# EAGLE schematic plinkplonk5 (EAGLE 7.5.0)
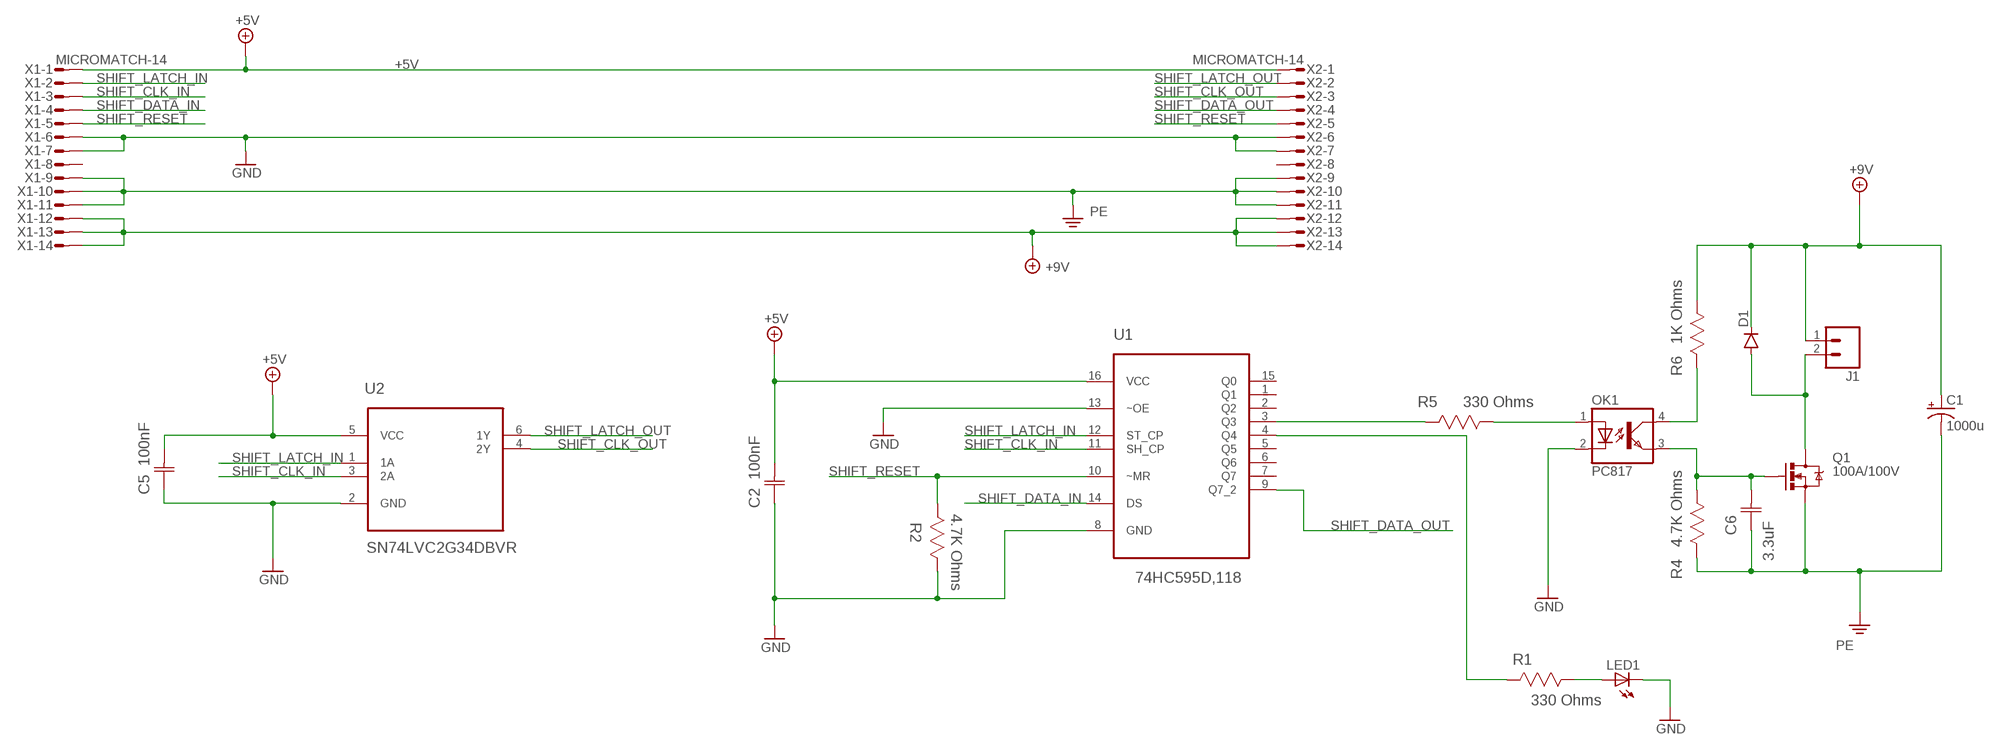
[diagram p0: schematic, sheet 1]

## Parts
C1  1000u  CAP_POLPTH4  [CPOL-RADIAL-1000UF-25V]
C2  100nF  C0805C104J5RACTU  [CAPC2013X110N]
C5  100nF  C0805C104J5RACTU  [CAPC2013X110N]
C6  3.3uF  C0805C104J5RACTU  [CAPC2013X110N]
D1  DIODEPTH  [DIODE-1N4001]
J1  M02JST-PTH-VERT  [JST-2-PTH-VERT]
LED1  LEDCHIPLED_1206  [CHIPLED_1206]
OK1  PC817  [DIL04]
Q1  100A/100V  MOSFET-NCHANNELPSMN7R0  [TO-263/D2PAK]
R1  330 Ohms  MC0.1W08051%9K1  [RESC2013X65N]
R2  4.7K Ohms  MC0.1W08051%9K1  [RESC2013X65N]
R4  4.7K Ohms  MC0.1W08051%9K1  [RESC2013X65N]
R5  330 Ohms  MC0.1W08051%9K1  [RESC2013X65N]
R6  1K Ohms  MC0.1W08051%9K1  [RESC2013X65N]
U1  74HC595D,118  [SOIC127P600X175-16N]
U2  SN74LVC2G34DBVR  [SOT95P280X145-6N]
X1  MICROMATCH-14  [MICROMATCH-14]
X2  MICROMATCH-14  [MICROMATCH-14]

## Nets
+5V: C2.2(C2) C5.2(C2) U1.16(VCC) U2.5(VCC) X1.1 X2.1
+9V: C1.+ D1.C J1.1 R6.1(R1) X1.12 X1.13 X1.14 X2.12 X2.13 X2.14
GND: C2.1(C1) C5.1(C1) LED1.C OK1.2(C) R2.1(R1) U1.8(GND) U1.13(~OE) U2.2(GND) X1.6 X1.7 X2.6 X2.7
N$1: D1.A J1.2 Q1.2(D)
N$2: R1.2(R2) U1.4(Q4)
N$3: C6.2(C2) OK1.3(EMIT) Q1.1(G) R4.1(R1)
N$4: LED1.A R1.1(R1)
N$5: OK1.4(COL) R6.2(R2)
N$6: R5.2(R2) U1.3(Q3)
N$7: OK1.1(A) R5.1(R1)
PE: C1.- C6.1(C1) Q1.3(S) R4.2(R2) X1.9 X1.10 X1.11 X2.9 X2.10 X2.11
SHIFT_CLK_IN: U1.11(SH_CP) U2.3(2A) X1.3
SHIFT_CLK_OUT: U2.4(2Y) X2.3
SHIFT_DATA_IN: U1.14(DS) X1.4
SHIFT_DATA_OUT: U1.9(Q7_2) X2.4
SHIFT_LATCH_IN: U1.12(ST_CP) U2.1(1A) X1.2
SHIFT_LATCH_OUT: U2.6(1Y) X2.2
SHIFT_RESET: R2.2(R2) U1.10(~MR) X1.5 X2.5
Unconnected: U1.1(Q1) U1.2(Q2) U1.5(Q5) U1.6(Q6) U1.7(Q7) U1.15(Q0) X1.8 X2.8

## Library data of the parts
C1 = SparkFun-Capacitors:CAP_POL: Capacitor Polarized These are standard SMD and PTH capacitors. Normally 10uF, 47uF, and 100uF in electrolytic and tantalum varieties. Always verify the external diameter of the through hole cap, it varies with capacity, voltage, and manufacturer. The EIA devices should be standard.
C2 C5 = Kemet_By_element14_Batch_1:C0805C104J5RACTU: CAPACITOR, 0805; MPN: C0805C104J5RACTU; OC_FARNELL: 1414663; OC_NEWARK: 64K2889; SUPPLIER: Kemet; TOLERANCE: ±5%; VOLTAGERATING: 50V
C6 = Kemet_By_element14_Batch_1:C0805C104J5RACTU: CAPACITOR, 0805; MPN: C0805C104J5RACTU; OC_FARNELL: 1414663; OC_NEWARK: 64K2889; SUPPLIER: Kemet; TOLERANCE: ±5%; VALUE: 100nF; VOLTAGERATING: 50V
D1 = SparkFun-DiscreteSemi:DIODE: Diode These are standard reverse protection diodes and small signal diodes. SMA package can handle up to about 1A. SOD-323 can handle about 200mA. What the SOD-323 package when ordering, there are some mfgs out there that are 5-pin packages.
J1 = SparkFun-Connectors:M02: Standard 2-pin 0.1" header. Use with - straight break away headers ( PRT-00116) - right angle break away headers (PRT-00553) - swiss pins (PRT-00743) - machine pins (PRT-00117) - female headers (PRT-00115) Molex polarized connector foot print use with: PRT-08233 with associated crimp pins and housings. 2.54_SCREWTERM for use with PRT-10571. 3.5mm Screw Terminal footprints for PRT-08084 5mm Screw Terminal footprints for use with PRT-08432
LED1 = led:LED: LED OSRAM: - CHIPLED LG R971, LG N971, LY N971, LG Q971, LY Q971, LO R971, LY R971 LH N974, LH R974 LS Q976, LO Q976, LY Q976 LO Q996 - Hyper CHIPLED LW Q18S LB Q993, LB Q99A, LB R99A - SideLED LS A670, LO A670, LY A670, LG A670, LP A670 LB A673, LV A673, LT A673, LW A673 LH A674 LY A675 LS A676, LA A676, LO A676, LY A676, LW A676 LS A679, LY A679, LG A679 - Hyper Micro SIDELED® LS Y876, LA Y876, LO Y876, LY Y876 LT Y87S - SmartLED LW L88C, LW L88S LB L89C, LB L89S, LG L890 LS L89K, LO L89K, LY L89K LS L896, LA L896, LO L896, LY L896 - TOPLED LS T670, LO T670, LY T670, LG T670, LP T670 LSG T670, LSP T670, LSY T670, LOP T670, LYG T670 LG T671, LOG T671, LSG T671 LB T673, LV T673, LT T673, LW T673 LH T674 LS T676, LA T676, LO T676, LY T676, LB T676, LH T676, LSB T676, LW T676 LB T67C, LV T67C, LT T67C, LS T67K, LO T67K, LY T67K, LW E67C LS E67B, LA E67B, LO E67B, LY E67B, LB E67C, LV E67C, LT E67C LW T67C LS T679, LY T679, LG T679 LS T770, LO T770, LY T770, LG T770, LP T770 LB T773, LV T773, LT T773, LW T773 LH T774 LS E675, LA E675, LY E675, LS T675 LS T776, LA T776, LO T776, LY T776, LB T776 LHGB T686 LT T68C, LB T68C - Hyper Mini TOPLED® LB M676 - Mini TOPLED Santana® LG M470 LS M47K, LO M47K, LY M47K Source: http://www.osram.convergy.de LUXEON: - LUMILED® LXK2-PW12-R00, LXK2-PW12-S00, LXK2-PW14-U00, LXK2-PW14-V00 LXK2-PM12-R00, LXK2-PM12-S00, LXK2-PM14-U00 LXK2-PE12-Q00, LXK2-PE12-R00, LXK2-PE12-S00, LXK2-PE14-T00, LXK2-PE14-U00 LXK2-PB12-K00, LXK2-PB12-L00, LXK2-PB12-M00, LXK2-PB14-N00, LXK2-PB14-P00, LXK2-PB14-Q00 LXK2-PR12-L00, LXK2-PR12-M00, LXK2-PR14-Q00, LXK2-PR14-R00 LXK2-PD12-Q00, LXK2-PD12-R00, LXK2-PD12-S00 LXK2-PH12-R00, LXK2-PH12-S00 LXK2-PL12-P00, LXK2-PL12-Q00, LXK2-PL12-R00 Source: www.luxeon.com KINGBRIGHT: KA-3528ASYC Source: www.kingbright.com
OK1 = optocoupler:PC817: SHARP OPTO COUPLER; MPN: PC817X4J000F; OC_FARNELL: 9707727; OC_NEWARK: 97K7059
Q1 = SparkFun-DiscreteSemi:MOSFET-NCHANNEL: Common NMOSFET Parts MFG P/N Store ID Prod ID FDD8780 TRANS-09984 SI7820DN TRANS-11055 FDS6630A IC-08089 2N7002PW TRANS-11151 FQP30N06L COM-10213 TRANS-10060 BSS123LT1G TRANS-08345 BSS138 TRANS-00830 BS170 2N7000; PROD_ID: TRANS-12437
R1 R2 R4-R6 = Multicomp_By_element14_Batch_1:MC0.1W08051%9K1: RESISTOR, 0805; MPN: MC0.1W08051%9K1; OC_FARNELL: 9333630; OC_NEWARK: 39K0321; SUPPLIER: Multicomp; TOLERANCE: ±1%; VALUE: 9.1K Ohms; WATTAGE: 1/10 W
U1 = NXP_By_element14_Batch_1:74HC595D,118: 8-bit serial-in, serial or parallel-out shift register with output latches 3-state; MPN: 74HC595D,118; OC_FARNELL: 1826845; OC_NEWARK: 78R6262; PACKAGE: SOIC-16; SUPPLIER: NXP Semiconductors
U2 = Texas Instruments_By_element14_Batch_1:SN74LVC2G34DBVR: DUAL BUFFER GATE; MPN: SN74LVC2G34DBVR; OC_FARNELL: 1470888; OC_NEWARK: 76C4213; PACKAGE: SOT-23-6; SUPPLIER: Texas Instruments
X1 X2 = con-amp-micromatch:MICROMATCH-14: MicroMaTch 14 8-215464-4 / 1-215464-4 Drawing Number C-215464 DDEController.pdf; MF: FARNELL; MPN: 8-215464-4; OC_FARNELL: 3784678; OC_NEWARK: 19J6431